# Altium schematic sheet IdealDiodeMain.SchDoc
size A3; SheetNumber: 1; SheetTotal: 2
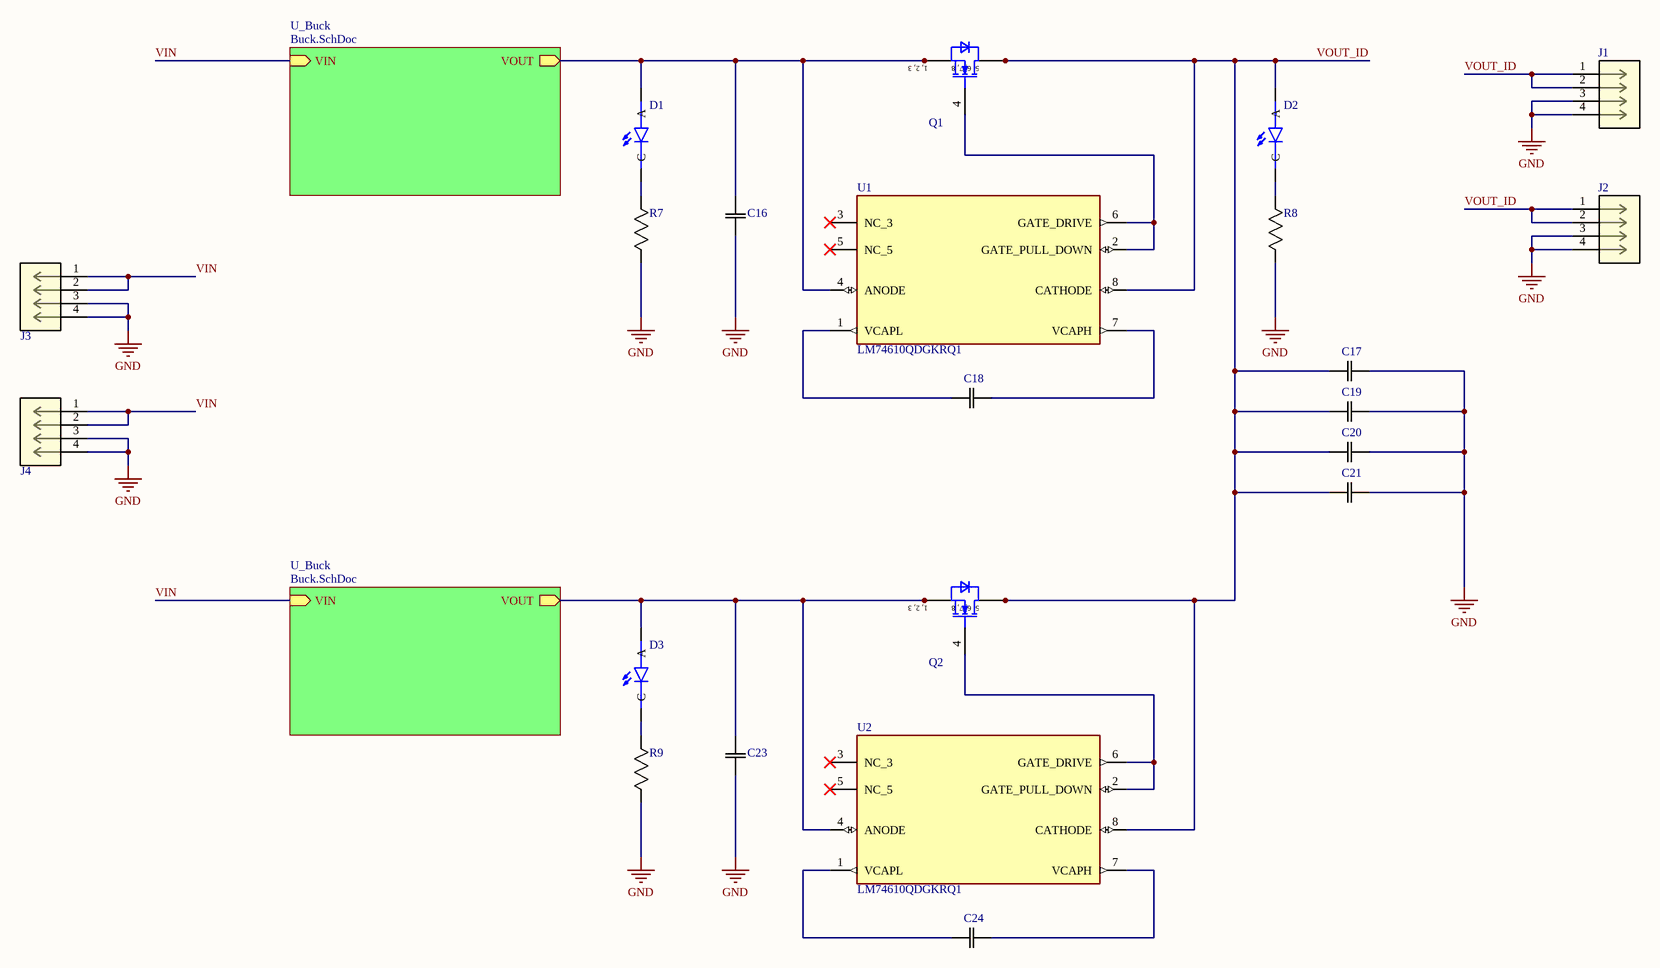
[diagram p0: IdealDiodeMain.SchDoc]

## Parts
C16  CC0402KRX7R9BB101  [CAP_0402]  (value not drawn)
C17  CGA4J1X7R1H475K125AC  [CAP_0805]  (value not drawn)
C18  GRM188Z71E225KE43D  [CAP_0603]  (value not drawn)
C19  CGA4J1X7R1H475K125AC  [CAP_0805]  (value not drawn)
C20  CC0603KRX7R9BB105  [CAP_0603]  (value not drawn)
C21  CC0603KRX7R9BB105  [CAP_0603]  (value not drawn)
C23  CC0402KRX7R9BB101  [CAP_0402]  (value not drawn)
C24  GRM188Z71E225KE43D  [CAP_0603]  (value not drawn)
D1  LTST-C190GKT  [LEDM1608X80]  (value not drawn)
D2  LTST-C190GKT  [LEDM1608X80]  (value not drawn)
D3  LTST-C190GKT  [LEDM1608X80]  (value not drawn)
J1  SM04B-PASS-TBT  [CONN_SM04B-PASS-_JST]  (value not drawn)
J2  SM04B-PASS-TBT  [CONN_SM04B-PASS-_JST]  (value not drawn)
J3  SM04B-PASS-TBT  [CONN_SM04B-PASS-_JST]  (value not drawn)
J4  SM04B-PASS-TBT  [CONN_SM04B-PASS-_JST]  (value not drawn)
Q1  BSZ034N04LSATMA1  [INF-PG-TSDSON-8-FL]  (value not drawn)
Q2  BSZ034N04LSATMA1  [INF-PG-TSDSON-8-FL]  (value not drawn)
R7  ERJ-PA2F1501X  [RES_0402]  (value not drawn)
R8  ERJ-PA2F1501X  [RES_0402]  (value not drawn)
R9  ERJ-PA2F1501X  [RES_0402]  (value not drawn)
U1  LM74610QDGKRQ1  [SOP65P490X110-8N]
U2  LM74610QDGKRQ1  [SOP65P490X110-8N]

## Sub-sheets
U_Buck = Buck.SchDoc: VIN (in), VOUT (out)
U_Buck = Buck.SchDoc: VIN (in), VOUT (out)

## Nets
GND: C16.1 C17.2 C19.2 C20.2 C21.2 C23.1 J1.3 J1.4 J2.3 J2.4 J3.3 J3.4 J4.3 J4.4 R7.2 R8.2 R9.2
VIN: J3.1 J3.2 J4.1 J4.2 ; sheet U_Buck/VIN, sheet U_Buck/VIN
VOUT_ID: C17.1 C19.1 C20.1 C21.1 D2.A J1.1 J1.2 J2.1 J2.2 Q1.5(DRAIN) Q1.6(DRAIN) Q1.7(DRAIN) Q1.8(DRAIN) Q2.5(DRAIN) Q2.6(DRAIN) Q2.7(DRAIN) Q2.8(DRAIN) U1.8(CATHODE) U2.8(CATHODE)
NetC16_2: C16.2 D1.A Q1.1(SOURCE) Q1.2(SOURCE) Q1.3(SOURCE) U1.4(ANODE) ; sheet U_Buck/VOUT
NetC18_1: C18.1 U1.1(VCAPL)
NetC18_2: C18.2 U1.7(VCAPH)
NetC23_2: C23.2 D3.A Q2.1(SOURCE) Q2.2(SOURCE) Q2.3(SOURCE) U2.4(ANODE) ; sheet U_Buck/VOUT
NetC24_1: C24.1 U2.1(VCAPL)
NetC24_2: C24.2 U2.7(VCAPH)
NetD1_C: D1.C R7.1
NetD2_C: D2.C R8.1
NetD3_C: D3.C R9.1
NetQ1_4: Q1.4(GATE) U1.2(GATE_PULL_DOWN) U1.6(GATE_DRIVE)
NetQ2_4: Q2.4(GATE) U2.2(GATE_PULL_DOWN) U2.6(GATE_DRIVE)

Not connected (* = marked no-connect by the designer): U1 3(NC_3)* 5(NC_5)*; U2 3(NC_3)* 5(NC_5)*

## Notes on the sheet
- (in symbol BSZ034N04LS) 1, 2, 3; 5, 6, 7, 8

## Library data of the parts
C16 C23 = CC0402KRX7R9BB101: 50V 100pF X7R ±10% 0402 Multilayer Ceramic Capacitors MLCC - SMD/SMT ROHS; Manufacturer: Yageo Group; Insulation Resistance: 100GΩ; Temperature Coefficient: 30ppm/°C; Supplier: DigiKey; Supplier Part Number: 311-1419-1-ND; Manufacturer Part Number: CC0402KRX7R9BB101; RoHS: Compliant; Category: Ceramic Capacitors; Stock: 385904; Pricing: 1=0.1, 10=0.024, 50=0.0156, 100=0.0133, 500=0.00926, 1000=0.00791, 2500=0.00676, 5000=0.00609 (USD); Value: 100pF; Case/Package: 0402; Case Code (Imperial): 0402; Case Code (Metric): 1005; China RoHS: Compliant; Composition: Ceramic; Depth: 500µm; Dielectric: X7R; Dielectric Material: Ceramic; Halogen Free: Halogen Free; Height: 500µm; Lead Free: Lead Free; Length: 1mm; Lifecycle Status: Production; Material: Ceramic; Max Operating Temperature: 125°C; Min Operating Temperature: -55°C; Mounting Technology: Surface Mount; Pins: 2; Number of Terminals: 2; Radiation Hardening: No; REACH SVHC: Yes; Schedule B: 8532240020, 8532240020|8532240020, 8532240020|8532240020|8532240020, 8532240020|8532240020|8532240020|8532240020; Termination: SMD/SMT; Thickness: 558.8µm; Tolerance: 10%; Voltage Rating: 50V; Voltage Rating (AC): 50V; Voltage Rating (DC): 50V; Weight: 652.039032µg; Width: 500µm; ComponentLink1URL: https://datasheet.octopart.com:443/CC0402KRX7R9BB101-Yageo-datasheet-177165144.pdf?src-supplier=IHS; ComponentLink1Description: https://datasheet.octopart.com:443/CC0402KRX7R9BB101-Yageo-datasheet-177165144.pdf?src-supplier=IHS; ComponentLink2URL: https://datasheet.octopart.com/CC0402KRX7R9BB101-Yageo-datasheet-10883670.pdf; ComponentLink2Description: https://datasheet.octopart.com/CC0402KRX7R9BB101-Yageo-datasheet-10883670.pdf; ComponentLink3URL: https://datasheet.octopart.com/CC0402KRX7R9BB101-Yageo-datasheet-12526321.pdf; ComponentLink3Description: https://datasheet.octopart.com/CC0402KRX7R9BB101-Yageo-datasheet-12526321.pdf; ComponentLink4URL: https://datasheet.octopart.com:443/CC0402KRX7R9BB101-Yageo-datasheet-78855684.pdf?src-supplier=Upverter; ComponentLink4Description: https://datasheet.octopart.com:443/CC0402KRX7R9BB101-Yageo-datasheet-78855684.pdf?src-supplier=Upverter; ComponentLink5URL: https://datasheet.octopart.com:443/CC0402KRX7R9BB101-Yageo-datasheet-147453679.pdf?src-supplier=Newark; ComponentLink5Description: https://datasheet.octopart.com:443/CC0402KRX7R9BB101-Yageo-datasheet-147453679.pdf?src-supplier=Newark; ComponentLink6URL: https://datasheet.octopart.com:443/CC0402KRX7R9BB101-Yageo-datasheet-5301394.pdf?src-supplier=Newark; ComponentLink6Description: https://datasheet.octopart.com:443/CC0402KRX7R9BB101-Yageo-datasheet-5301394.pdf?src-supplier=Newark; ComponentLink7URL: https://datasheet.octopart.com:443/CC0402KRX7R9BB101-Yageo-datasheet-62336348.pdf?src-supplier=element14+APAC; ComponentLink7Description: https://datasheet.octopart.com:443/CC0402KRX7R9BB101-Yageo-datasheet-62336348.pdf?src-supplier=element14+APAC; ComponentLink8URL: https://datasheet.octopart.com:443/CC0402KRX7R9BB101-Yageo-datasheet-166511530.pdf?src-supplier=Future+Electronics; ComponentLink8Description: https://datasheet.octopart.com:443/CC0402KRX7R9BB101-Yageo-datasheet-166511530.pdf?src-supplier=Future+Electronics; ComponentLink9URL: https://datasheet.octopart.com:443/CC0402KRX7R9BB101-Yageo-datasheet-137700082.pdf?src-supplier=Future+Electronics; ComponentLink9Description: https://datasheet.octopart.com:443/CC0402KRX7R9BB101-Yageo-datasheet-137700082.pdf?src-supplier=Future+Electronics; ComponentLink10URL: https://datasheet.octopart.com:443/CC0402KRX7R9BB101-Yageo-datasheet-137700084.pdf?src-supplier=Future+Electronics; ComponentLink10Description: https://datasheet.octopart.com:443/CC0402KRX7R9BB101-Yageo-datasheet-137700084.pdf?src-supplier=Future+Electronics; ComponentLink11URL: https://datasheet.octopart.com:443/CC0402KRX7R9BB101-Yageo-datasheet-27626582.pdf?src-supplier=Future+Electronics; ComponentLink11Description: https://datasheet.octopart.com:443/CC0402KRX7R9BB101-Yageo-datasheet-27626582.pdf?src-supplier=Future+Electronics; ComponentLink12URL: https://datasheet.octopart.com:443/CC0402KRX7R9BB101-Yageo-datasheet-24578986.pdf?src-supplier=Future+Electronics; ComponentLink12Description: https://datasheet.octopart.com:443/CC0402KRX7R9BB101-Yageo-datasheet-24578986.pdf?src-supplier=Future+Electronics; ComponentLink13URL: https://datasheet.octopart.com:443/CC0402KRX7R9BB101-Yageo-datasheet-15895757.pdf?src-supplier=Future+Electronics; ComponentLink13Description: https://datasheet.octopart.com:443/CC0402KRX7R9BB101-Yageo-datasheet-15895757.pdf?src-supplier=Future+Electronics; ComponentLink14URL: https://datasheet.octopart.com:443/CC0402KRX7R9BB101-Yageo-datasheet-8324192.pdf?src-supplier=Future+Electronics; ComponentLink14Description: https://datasheet.octopart.com:443/CC0402KRX7R9BB101-Yageo-datasheet-8324192.pdf?src-supplier=Future+Electronics; ComponentLink15URL: https://datasheet.octopart.com:443/CC0402KRX7R9BB101-Yageo-datasheet-151948686.pdf?src-supplier=Farnell; ComponentLink15Description: https://datasheet.octopart.com:443/CC0402KRX7R9BB101-Yageo-datasheet-151948686.pdf?src-supplier=Farnell; ComponentLink16URL: http://sigma.octopart.com:80/rohs_statement/Surface-Mount-Ceramic-Multilayer-Capacitors%3B-General-Purpose-%26-High-Capacitance-Class-2%2C-X7R-Yageo-family-124.pdf?src-supplier=Compliance+Statements; ComponentLink16Description: http://sigma.octopart.com:80/rohs_statement/Surface-Mount-Ceramic-Multilayer-Capacitors%3B-General-Purpose-%26-High-Capacitance-Class-2%2C-X7R-Yageo-family-124.pdf?src-supplier=Compliance+Statements; ComponentLink17URL: http://sigma.octopart.com:80/reach_statement/Surface-Mount-Ceramic-Multilayer-Capacitors%3B-General-Purpose-%26-High-Capacitance-Class-2%2C-X7R-Yageo-family-125.pdf?src-supplier=Compliance+Statements; ComponentLink17Description: http://sigma.octopart.com:80/reach_statement/Surface-Mount-Ceramic-Multilayer-Capacitors%3B-General-Purpose-%26-High-Capacitance-Class-2%2C-X7R-Yageo-family-125.pdf?src-supplier=Compliance+Statements; ComponentLink18URL: http://sigma.octopart.com:80/rohs_statement/Yageo-company-2.pdf?src-supplier=Compliance+Statements; ComponentLink18Description: http://sigma.octopart.com:80/rohs_statement/Yageo-company-2.pdf?src-supplier=Compliance+Statements; ComponentLink19URL: http://sigma.octopart.com:80/conflict_mineral_statement/Yageo-company-3.pdf?src-supplier=Compliance+Statements; ComponentLink19Description: http://sigma.octopart.com:80/conflict_mineral_statement/Yageo-company-3.pdf?src-supplier=Compliance+Statements
C17 C19 = CGA4J1X7R1H475K125AC: Ceramic Capacitor, Multilayer, Ceramic, 50V, 10% +Tol, 10% -Tol, X7R, 15% TC, 4.7uF, Surface Mount, 0805; Manufacturer: TDK; Manufacturer Lifecycle Status: PRODUCTION; Value: 4.7µF; Supplier: DigiKey; Supplier Part Number: 445-181404-1-ND; Manufacturer Part Number: CGA4J1X7R1H475K125AC; RoHS: Compliant; Category: Ceramic Capacitors; Stock: 396272; Pricing: 1=0.52, 10=0.32, 50=0.2408, 100=0.2046, 500=0.17482, 1000=0.16204 (USD); Case/Package: 0805; China RoHS: Compliant; Dielectric Material: Ceramic; Height: 1.25mm; Length: 2mm; Lifecycle Status: Production; Material: Ceramic; Max Length: 2.25mm; Max Operating Temperature: 125°C; Max Width: 1.5mm; Min Length: 1.85mm; Min Operating Temperature: -55°C; Min Width: 1.1mm; Mounting Technology: Surface Mount; Number of Terminals: 2; REACH SVHC: Yes; Schedule B: 8532240020, 8532240020|8532240020|8532240020|8532240020|8532240020; Voltage Rating: 50V; Voltage Rating (DC): 50V; Width: 1.25mm; ComponentLink1URL: https://datasheet.octopart.com:443/CGA4J1X7R1H475K125AC-TDK-datasheet-165583812.pdf?src-supplier=IHS; ComponentLink1Description: https://datasheet.octopart.com:443/CGA4J1X7R1H475K125AC-TDK-datasheet-165583812.pdf?src-supplier=IHS; ComponentLink2URL: https://datasheet.octopart.com:443/CGA4J1X7R1H475K125AC-TDK-datasheet-138890726.pdf?src-supplier=Future+Electronics; ComponentLink2Description: https://datasheet.octopart.com:443/CGA4J1X7R1H475K125AC-TDK-datasheet-138890726.pdf?src-supplier=Future+Electronics; ComponentLink3URL: https://datasheet.octopart.com:443/CGA4J1X7R1H475K125AC-TDK-datasheet-151546526.pdf?src-supplier=TDK; ComponentLink3Description: https://datasheet.octopart.com:443/CGA4J1X7R1H475K125AC-TDK-datasheet-151546526.pdf?src-supplier=TDK; ComponentLink4URL: https://datasheet.octopart.com:443/CGA4J1X7R1H475K125AC-TDK-datasheet-140571036.pdf?src-supplier=Arrow.cn; ComponentLink4Description: https://datasheet.octopart.com:443/CGA4J1X7R1H475K125AC-TDK-datasheet-140571036.pdf?src-supplier=Arrow.cn
C18 C24 = GRM188Z71E225KE43D: 25V 2.2uF X7R ±10% 0603 Multilayer Ceramic Capacitors MLCC - SMD/SMT ROHS; Manufacturer: Murata; Manufacturer Lifecycle Status: IN PRODUCTION; Value: 2.2µF; Supplier: DigiKey; Supplier Part Number: 490-GRM188Z71E225KE43DDKR-ND; Manufacturer Part Number: GRM188Z71E225KE43D; RoHS: Compliant; Category: Ceramic Capacitors; Stock: 47639; Pricing: 1=0.18, 10=0.105, 50=0.0744, 100=0.065, 500=0.04942, 1000=0.04462 (USD); Case/Package: 0603; Dielectric Material: Ceramic; Height: 800µm; Length: 1.6mm; Lifecycle Status: Production; Material: Ceramic; Max Operating Temperature: 125°C; Min Operating Temperature: -55°C; Mounting Technology: Surface Mount; Number of Terminals: 2; REACH SVHC: Yes; Thickness: 800µm; Tolerance: 10%; Voltage Rating: 25V; Voltage Rating (DC): 25V; Width: 800µm; ComponentLink1URL: https://datasheet.octopart.com:443/GRM188Z71E225KE43D-Murata-datasheet-141276026.pdf?src-supplier=Geoflip; ComponentLink1Description: https://datasheet.octopart.com:443/GRM188Z71E225KE43D-Murata-datasheet-141276026.pdf?src-supplier=Geoflip; ComponentLink2URL: https://datasheet.octopart.com:443/GRM188Z71E225KE43D-Murata-datasheet-165579666.pdf?src-supplier=TME; ComponentLink2Description: https://datasheet.octopart.com:443/GRM188Z71E225KE43D-Murata-datasheet-165579666.pdf?src-supplier=TME; ComponentLink3URL: https://datasheet.octopart.com:443/GRM188Z71E225KE43D-Murata-datasheet-140705919.pdf?src-supplier=Ciiva; ComponentLink3Description: https://datasheet.octopart.com:443/GRM188Z71E225KE43D-Murata-datasheet-140705919.pdf?src-supplier=Ciiva; ComponentLink4URL: https://datasheet.octopart.com:443/GRM188Z71E225KE43D-Murata-datasheet-138743437.pdf?src-supplier=Ciiva; ComponentLink4Description: https://datasheet.octopart.com:443/GRM188Z71E225KE43D-Murata-datasheet-138743437.pdf?src-supplier=Ciiva; ComponentLink5URL: http://sigma.octopart.com:80/reach_statement/Murata-company-16.pdf?src-supplier=Compliance+Statements; ComponentLink5Description: http://sigma.octopart.com:80/reach_statement/Murata-company-16.pdf?src-supplier=Compliance+Statements
C20 C21 = CC0603KRX7R9BB105: 50V 1uF X7R ±10% 0603 Multilayer Ceramic Capacitors MLCC - SMD/SMT ROHS; Manufacturer: Yageo Group; Value: 1µF; Supplier: DigiKey; Supplier Part Number: 311-2082-1-ND; Manufacturer Part Number: CC0603KRX7R9BB105; RoHS: Compliant; Category: Ceramic Capacitors; Stock: 118343; Pricing: 1=0.47, 10=0.284, 50=0.2124, 100=0.1795, 500=0.15282, 1000=0.14128 (USD); Case/Package: 0603; Case Code (Imperial): 0603; Case Code (Metric): 1608; China RoHS: Compliant; Composition: Ceramic; Dielectric: X7R; Dielectric Material: Ceramic; Halogen Free: Halogen Free; Height: 800µm; Lead Free: Lead Free; Length: 1.6mm; Lifecycle Status: Production; Material: Ceramic; Max Operating Temperature: 125°C; Min Operating Temperature: -55°C; Mounting Technology: Surface Mount; Number of Terminals: 2; Packaging: Tape & Reel (TR); REACH SVHC: Yes; Schedule B: 8532240020, 8532240020|8532240020|8532240020|8532240020|8532240020; Termination: SMD/SMT; Thickness: 889µm; Tolerance: 10%; Voltage Rating: 50V; Voltage Rating (DC): 50V; Weight: 2.012816mg; Width: 800µm; ComponentLink1URL: https://datasheet.octopart.com:443/CC0603KRX7R9BB105-Yageo-datasheet-177165144.pdf?src-supplier=IHS; ComponentLink1Description: https://datasheet.octopart.com:443/CC0603KRX7R9BB105-Yageo-datasheet-177165144.pdf?src-supplier=IHS; ComponentLink2URL: https://datasheet.octopart.com:443/CC0603KRX7R9BB105-Yageo-datasheet-82288757.pdf?src-supplier=Upverter; ComponentLink2Description: https://datasheet.octopart.com:443/CC0603KRX7R9BB105-Yageo-datasheet-82288757.pdf?src-supplier=Upverter; ComponentLink3URL: https://datasheet.octopart.com:443/CC0603KRX7R9BB105-Yageo-datasheet-149070022.pdf?src-supplier=Upverter; ComponentLink3Description: https://datasheet.octopart.com:443/CC0603KRX7R9BB105-Yageo-datasheet-149070022.pdf?src-supplier=Upverter; ComponentLink4URL: https://sigma.octopart.com:443/147830939/technical_drawing/Yageo-CC0603KRX7R9BB105.pdf?src-supplier=Upverter; ComponentLink4Description: https://sigma.octopart.com:443/147830939/technical_drawing/Yageo-CC0603KRX7R9BB105.pdf?src-supplier=Upverter; ComponentLink5URL: https://datasheet.octopart.com:443/CC0603KRX7R9BB105-Yageo-datasheet-181968729.pdf?src-supplier=Newark; ComponentLink5Description: https://datasheet.octopart.com:443/CC0603KRX7R9BB105-Yageo-datasheet-181968729.pdf?src-supplier=Newark; ComponentLink6URL: https://datasheet.octopart.com:443/CC0603KRX7R9BB105-Yageo-datasheet-147453679.pdf?src-supplier=Newark; ComponentLink6Description: https://datasheet.octopart.com:443/CC0603KRX7R9BB105-Yageo-datasheet-147453679.pdf?src-supplier=Newark; ComponentLink7URL: https://datasheet.octopart.com:443/CC0603KRX7R9BB105-Yageo-datasheet-181964739.pdf?src-supplier=Farnell; ComponentLink7Description: https://datasheet.octopart.com:443/CC0603KRX7R9BB105-Yageo-datasheet-181964739.pdf?src-supplier=Farnell; ComponentLink8URL: https://datasheet.octopart.com:443/CC0603KRX7R9BB105-Yageo-datasheet-151948686.pdf?src-supplier=TME; ComponentLink8Description: https://datasheet.octopart.com:443/CC0603KRX7R9BB105-Yageo-datasheet-151948686.pdf?src-supplier=TME; ComponentLink9URL: https://datasheet.octopart.com:443/CC0603KRX7R9BB105-Yageo-datasheet-166511530.pdf?src-supplier=Future+Electronics; ComponentLink9Description: https://datasheet.octopart.com:443/CC0603KRX7R9BB105-Yageo-datasheet-166511530.pdf?src-supplier=Future+Electronics; ComponentLink10URL: https://datasheet.octopart.com:443/CC0603KRX7R9BB105-Yageo-datasheet-137700082.pdf?src-supplier=Future+Electronics; ComponentLink10Description: https://datasheet.octopart.com:443/CC0603KRX7R9BB105-Yageo-datasheet-137700082.pdf?src-supplier=Future+Electronics; ComponentLink11URL: https://datasheet.octopart.com:443/CC0603KRX7R9BB105-Yageo-Group-datasheet-165992755.pdf?src-supplier=ODG+(Origin+Data+Global); ComponentLink11Description: https://datasheet.octopart.com:443/CC0603KRX7R9BB105-Yageo-Group-datasheet-165992755.pdf?src-supplier=ODG+(Origin+Data+Global); ComponentLink12URL: https://datasheet.octopart.com/Surface-Mount-Ceramic-Multilayer-Capacitors%3B-General-Purpose-%26-High-Capacitance-Class-2%2C-X7R-Yageo-datasheet-family-114.pdf; ComponentLink12Description: https://datasheet.octopart.com/Surface-Mount-Ceramic-Multilayer-Capacitors%3B-General-Purpose-%26-High-Capacitance-Class-2%2C-X7R-Yageo-datasheet-family-114.pdf; ComponentLink13URL: https://datasheet.octopart.com/CC0603KRX7R9BB105-Yageo-datasheet-10883670.pdf; ComponentLink13Description: https://datasheet.octopart.com/CC0603KRX7R9BB105-Yageo-datasheet-10883670.pdf; ComponentLink14URL: http://sigma.octopart.com:80/rohs_statement/Surface-Mount-Ceramic-Multilayer-Capacitors%3B-General-Purpose-%26-High-Capacitance-Class-2%2C-X7R-Yageo-family-124.pdf?src-supplier=Compliance+Statements; ComponentLink14Description: http://sigma.octopart.com:80/rohs_statement/Surface-Mount-Ceramic-Multilayer-Capacitors%3B-General-Purpose-%26-High-Capacitance-Class-2%2C-X7R-Yageo-family-124.pdf?src-supplier=Compliance+Statements; ComponentLink15URL: http://sigma.octopart.com:80/reach_statement/Surface-Mount-Ceramic-Multilayer-Capacitors%3B-General-Purpose-%26-High-Capacitance-Class-2%2C-X7R-Yageo-family-125.pdf?src-supplier=Compliance+Statements; ComponentLink15Description: http://sigma.octopart.com:80/reach_statement/Surface-Mount-Ceramic-Multilayer-Capacitors%3B-General-Purpose-%26-High-Capacitance-Class-2%2C-X7R-Yageo-family-125.pdf?src-supplier=Compliance+Statements; ComponentLink16URL: http://sigma.octopart.com:80/rohs_statement/Yageo-company-2.pdf?src-supplier=Compliance+Statements; ComponentLink16Description: http://sigma.octopart.com:80/rohs_statement/Yageo-company-2.pdf?src-supplier=Compliance+Statements; ComponentLink17URL: http://sigma.octopart.com:80/conflict_mineral_statement/Yageo-company-3.pdf?src-supplier=Compliance+Statements; ComponentLink17Description: http://sigma.octopart.com:80/conflict_mineral_statement/Yageo-company-3.pdf?src-supplier=Compliance+Statements
D1-D3 = LTST-C190GKT: Green 569nm LED Indication - Discrete 2.1V 0603 (1608 Metric); MF: {'manufacturer': u'Lite-On Inc.'}; Package: None; Price: None; Value: *; MP: LTST-C190GKT; Availability: Unavailable
J1-J4 = SM04B-PASS-TBT: Connector Header Surface Mount, Right Angle 4 position 0.079" (2.00mm); Manufacturer_Name: JST; Copyright: Copyright (C) 2025 Ultra Librarian. All rights reserved.; Manufacturer_Part_Number: SM04B-PASS-TBT; RefDes: RefDes; Type: Type
Q1 Q2 = BSZ034N04LS: N-Channel 40 V 19A (Ta), 40A (Tc) 2.1W (Ta), 52W (Tc) Surface Mount PG-TSDSON-8-FL; Manufacturer: Infineon Technologies; ManufacturerPartNumber: BSZ034N04LS; PackageReference: PG-TSDSON-8 FL
R7-R9 = ERJPA2F1501X: Res Thick Film 0402 1.5K Ohm 1% 0.2W(1/5W) ±100ppm/C Pad SMD T/R Automotive AEC-Q200; Manufacturer: Panasonic; Max Power Dissipation: 200mW; Value: 1.5kΩ; Temperature Coefficient: 100ppm/°C; Voltage Rating: 50V; Supplier: DigiKey; Supplier Part Number: P17225DKR-ND; Manufacturer Part Number: ERJPA2F1501X; RoHS: Compliant; Category: Chip SMD Resistors; Stock: 65504; Pricing: 1=0.19, 10=0.094, 25=0.0744, 50=0.063, 100=0.0474, 250=0.0402, 500=0.038, 1000=0.03306, 5000=0.02959 (USD); Case/Package: 0402; Case Code (Imperial): 0402; Case Code (Metric): 1005; Composition: Thick Film; Features: Automotive AEC-Q200; Height: 350µm; Length: 990.6µm; Lifecycle Status: Production; Max Operating Temperature: 155°C; Min Operating Temperature: -55°C; Mounting Technology: Surface Mount; Number of Terminals: 2; Number of Terminations: 2; Power Dissipation: 200mW; Power Rating: 200mW; REACH SVHC: Yes; Schedule B: 8533210045, 8533210045|8533210045|8533210045|8533210045|8533210045; Tolerance: 1%; Voltage Rating (DC): 50V; Width: 500µm; Working Voltage: 50V; ComponentLink1URL: https://datasheet.octopart.com:443/ERJPA2F1501X-Panasonic-datasheet-182147306.pdf?src-supplier=IHS; ComponentLink1Description: https://datasheet.octopart.com:443/ERJPA2F1501X-Panasonic-datasheet-182147306.pdf?src-supplier=IHS; ComponentLink2URL: https://datasheet.octopart.com:443/ERJPA2F1501X-Panasonic-datasheet-68299097.pdf?src-supplier=Future+Electronics; ComponentLink2Description: https://datasheet.octopart.com:443/ERJPA2F1501X-Panasonic-datasheet-68299097.pdf?src-supplier=Future+Electronics; ComponentLink3URL: https://datasheet.octopart.com:443/ERJPA2F1501X-Panasonic-datasheet-136608609.pdf?src-supplier=Newark; ComponentLink3Description: https://datasheet.octopart.com:443/ERJPA2F1501X-Panasonic-datasheet-136608609.pdf?src-supplier=Newark; ComponentLink4URL: https://datasheet.octopart.com:443/ERJPA2F1501X-Panasonic-datasheet-62334979.pdf?src-supplier=Newark; ComponentLink4Description: https://datasheet.octopart.com:443/ERJPA2F1501X-Panasonic-datasheet-62334979.pdf?src-supplier=Newark
U1 U2 = LM74610QDGKRQ1: 0.48-V to 42-V, zero IQ automotive ideal diode controller; MF: Texas Instruments; SnapEDA_Link: https://www.snapeda.com/parts/LM74610QDGKRQ1/Texas+Instruments/view-part/?ref=snap; Package: VSSOP-8 Texas Instruments; Value: *; MP: LM74610QDGKRQ1; Check_prices: https://www.snapeda.com/parts/LM74610QDGKRQ1/Texas+Instruments/view-part/?ref=eda